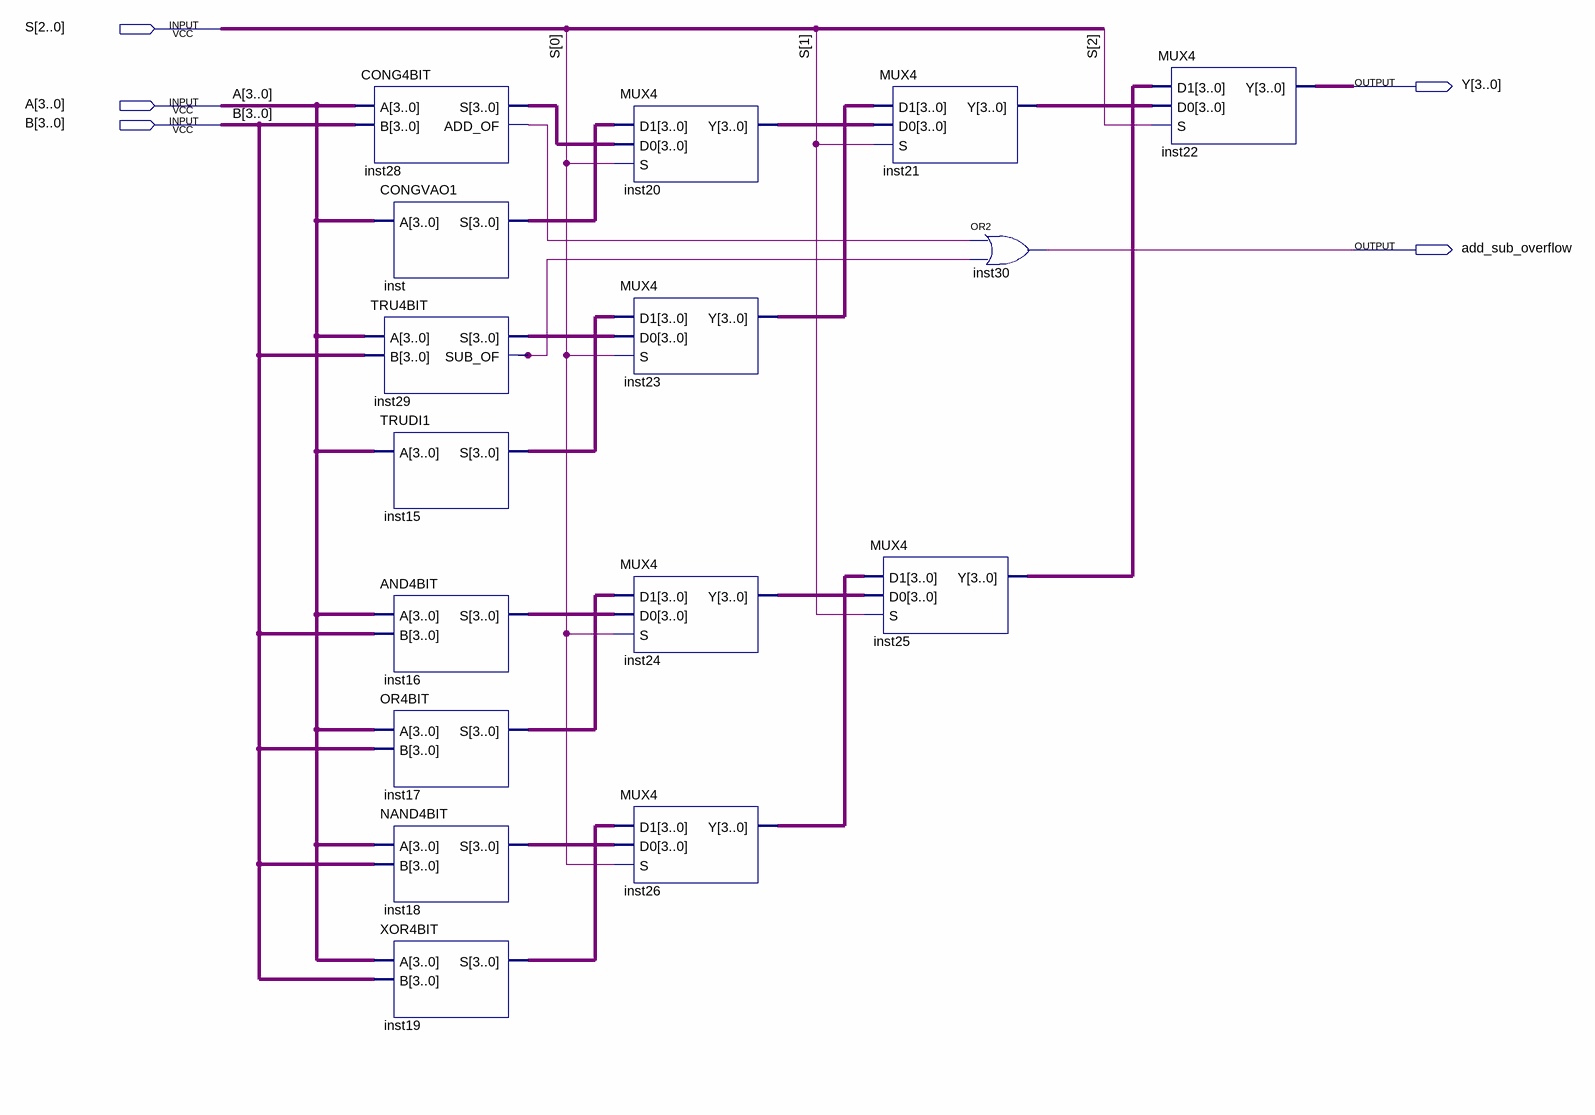
[diagram p0: schematic sheet]
// Quartus schematic ALU.bdf as structural Verilog: 16 symbols, 5 pins
module ALU (
  input  [2:0] S,
  input  [3:0] A,
  input  [3:0] B,
  output [3:0] Y,
  output add_sub_overflow
);

  wire inst28_add_of, inst29_sub_of;
  wire [3:0] inst15_s, inst16_s, inst17_s, inst18_s, inst19_s, inst20_y, inst21_y, inst23_y, inst24_y,
       inst25_y, inst26_y, inst28_s, inst29_s, inst_s;

  CONG4BIT inst28 (.A(A), .B(B), .S(inst28_s), .ADD_OF(inst28_add_of));
  CONGVAO1 inst (.A(A), .S(inst_s));
  TRU4BIT inst29 (.A(A), .B(B), .S(inst29_s), .SUB_OF(inst29_sub_of));
  TRUDI1 inst15 (.A(A), .S(inst15_s));
  AND4BIT inst16 (.A(A), .B(B), .S(inst16_s));
  OR4BIT inst17 (.A(A), .B(B), .S(inst17_s));
  NAND4BIT inst18 (.A(A), .B(B), .S(inst18_s));
  XOR4BIT inst19 (.A(A), .B(B), .S(inst19_s));
  MUX4 inst20 (.D1(inst_s), .D0(inst28_s), .S(S[0]), .Y(inst20_y));
  MUX4 inst23 (.D1(inst15_s), .D0(inst29_s), .S(S[0]), .Y(inst23_y));
  MUX4 inst24 (.D1(inst17_s), .D0(inst16_s), .S(S[0]), .Y(inst24_y));
  MUX4 inst26 (.D1(inst19_s), .D0(inst18_s), .S(S[0]), .Y(inst26_y));
  MUX4 inst21 (.D1(inst23_y), .D0(inst20_y), .S(S[1]), .Y(inst21_y));
  MUX4 inst25 (.D1(inst26_y), .D0(inst24_y), .S(S[1]), .Y(inst25_y));
  or inst30 (add_sub_overflow, inst28_add_of, inst29_sub_of);
  MUX4 inst22 (.D1(inst25_y), .D0(inst21_y), .S(S[2]), .Y(Y));
endmodule
